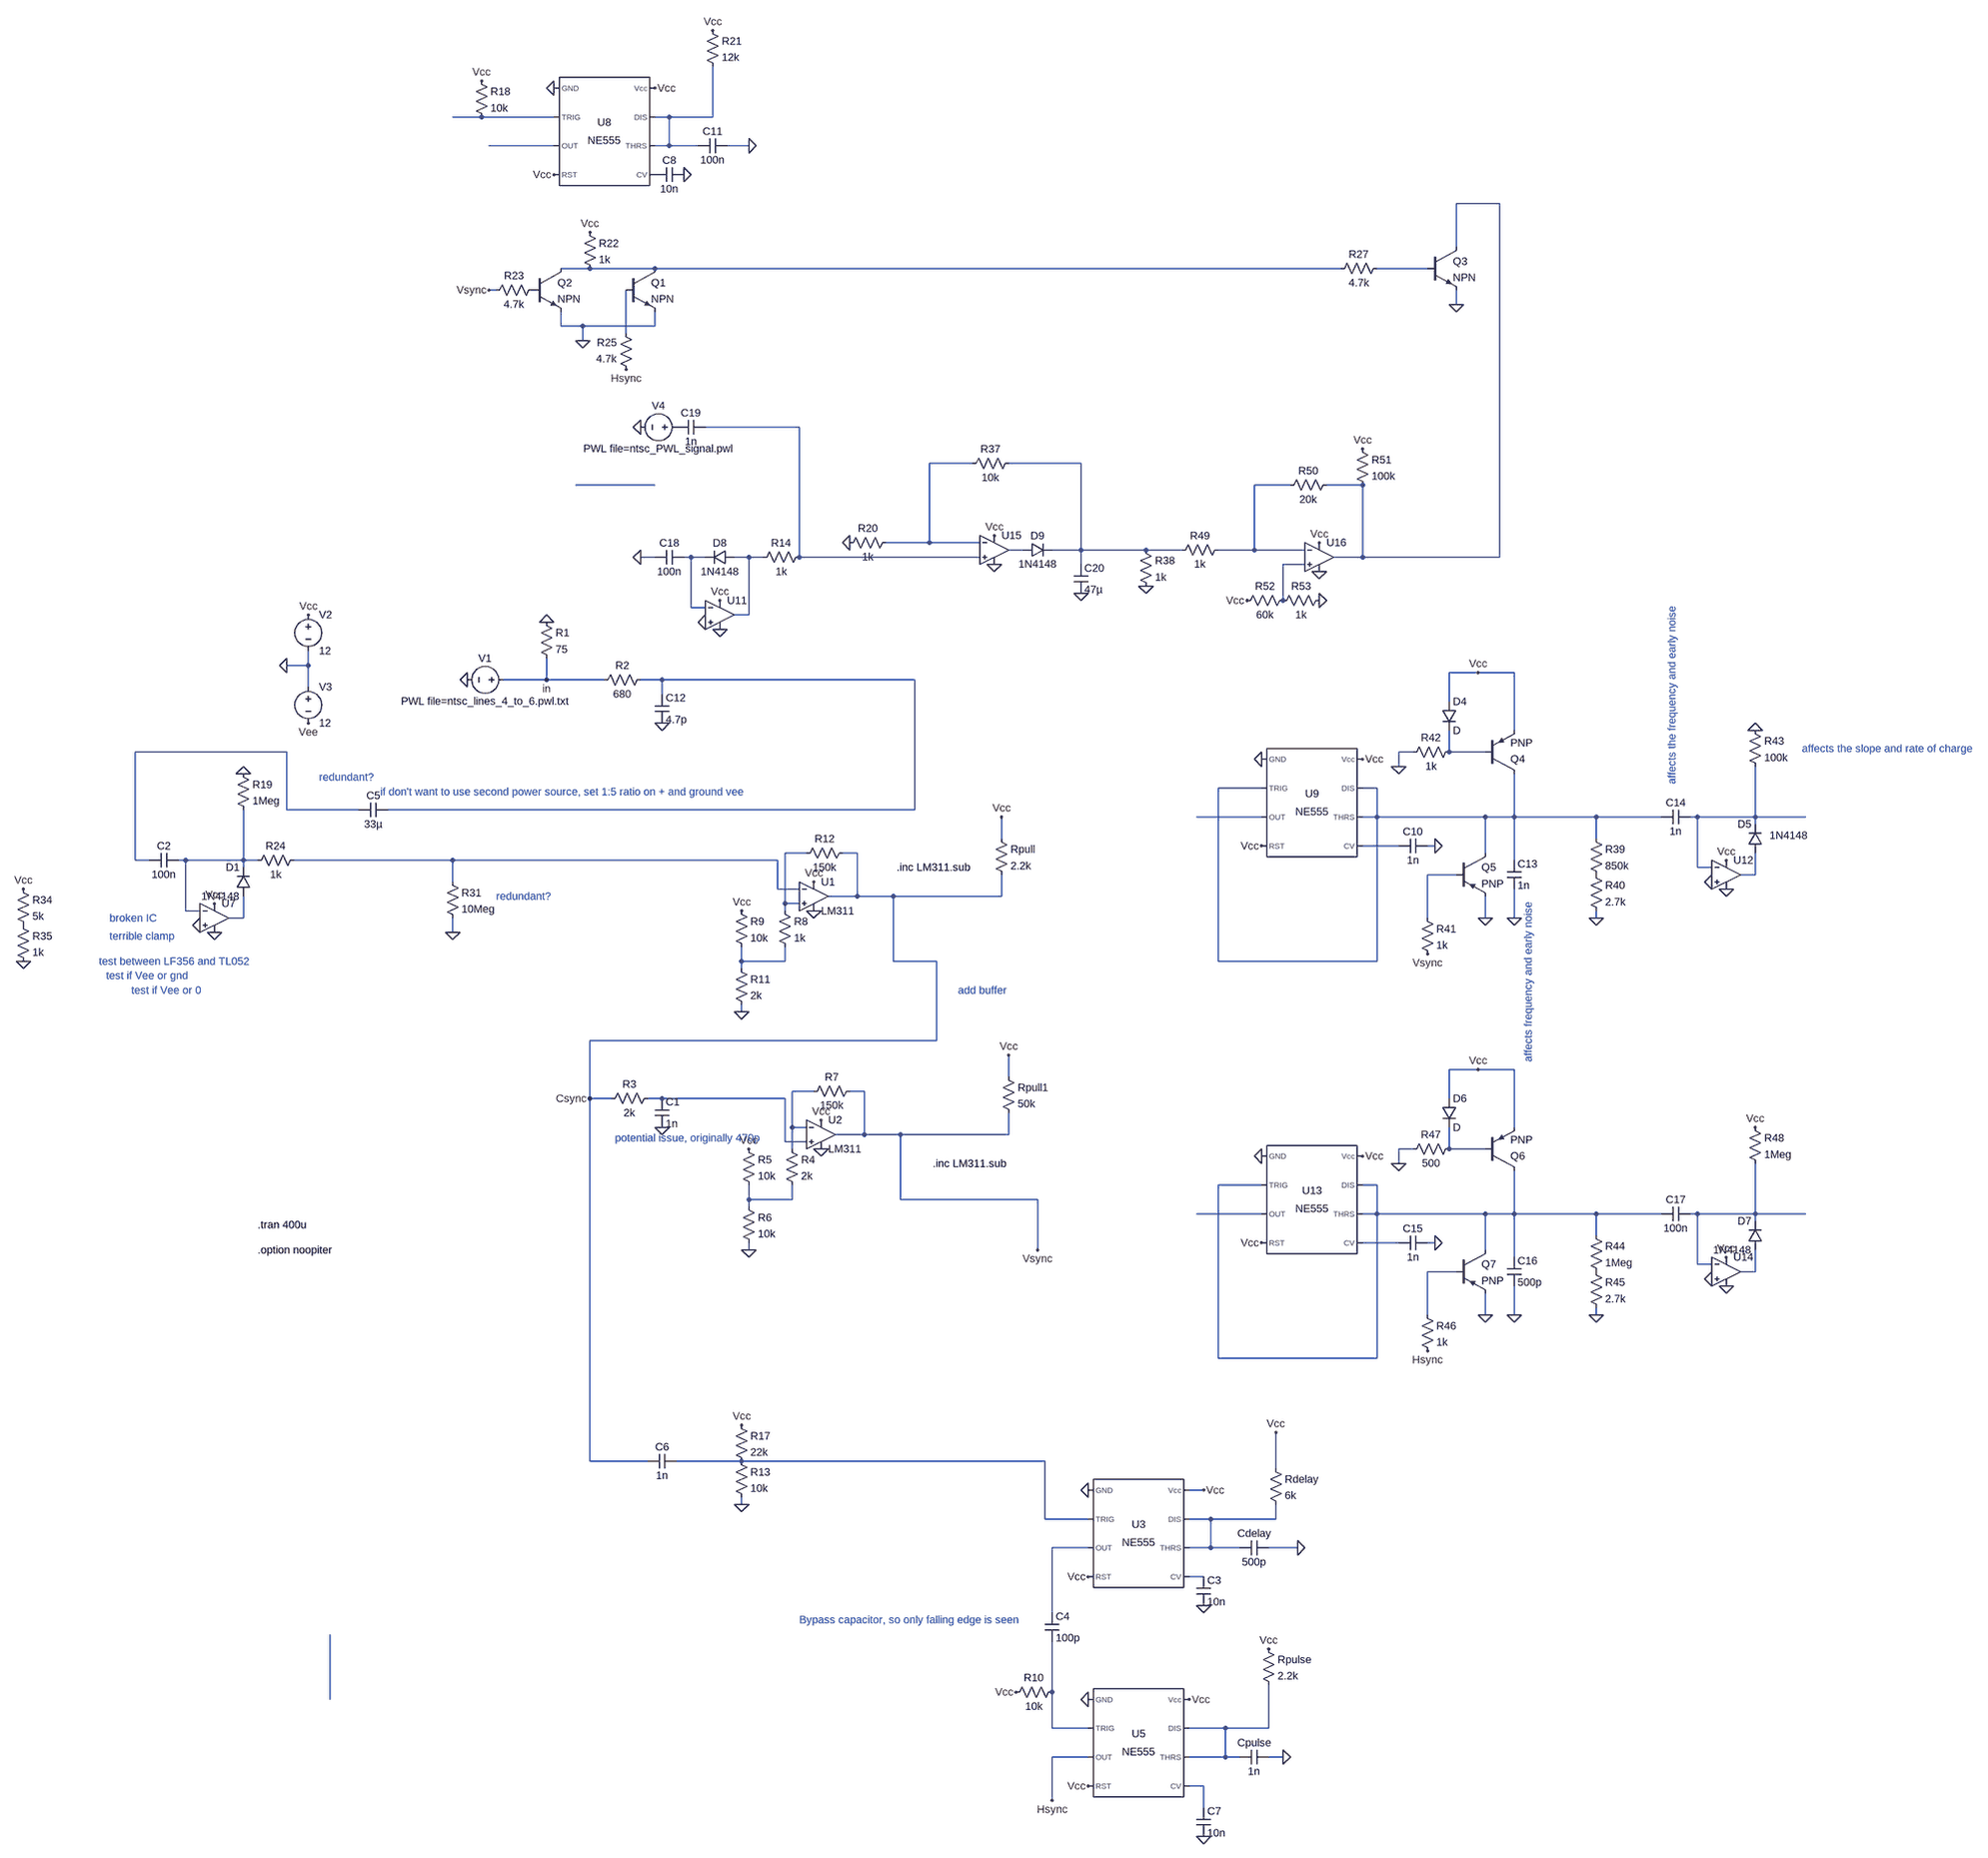
[diagram p0: schematic postFailurebutWOrse.asc]
postFailurebutWOrse.asc, the LTspice schematic file:
Version 4.1
SHEET 1 4812 2948
WIRE 16 -1440 -48 -1440
WIRE 176 -1440 16 -1440
WIRE 432 -1440 400 -1440
WIRE 528 -1440 528 -1552
WIRE 528 -1440 432 -1440
WIRE 176 -1376 32 -1376
WIRE 432 -1376 432 -1440
WIRE 432 -1376 400 -1376
WIRE 496 -1376 432 -1376
WIRE 608 -1376 560 -1376
WIRE 2272 -1248 2176 -1248
WIRE 2176 -1152 2176 -1248
WIRE 256 -1104 192 -1104
WIRE 400 -1104 256 -1104
WIRE 1920 -1104 400 -1104
WIRE 2112 -1104 2000 -1104
WIRE 48 -1056 32 -1056
WIRE 2176 -1024 2176 -1056
WIRE 192 -976 192 -1008
WIRE 240 -976 192 -976
WIRE 400 -976 400 -1008
WIRE 400 -976 240 -976
WIRE 336 -960 336 -1056
WIRE 240 -944 240 -976
WIRE 720 -752 512 -752
WIRE 1104 -672 1008 -672
WIRE 1344 -672 1184 -672
WIRE 400 -624 224 -624
WIRE 1808 -624 1728 -624
WIRE 1968 -624 1888 -624
WIRE 1008 -496 1008 -672
WIRE 1008 -496 912 -496
WIRE 1120 -496 1008 -496
WIRE 1216 -480 1184 -480
WIRE 1344 -480 1344 -672
WIRE 1344 -480 1280 -480
WIRE 1488 -480 1344 -480
WIRE 1568 -480 1488 -480
WIRE 1728 -480 1728 -624
WIRE 1728 -480 1648 -480
WIRE 1840 -480 1728 -480
WIRE 400 -464 368 -464
WIRE 480 -464 464 -464
WIRE 512 -464 480 -464
WIRE 608 -464 576 -464
WIRE 640 -464 608 -464
WIRE 720 -464 720 -752
WIRE 1120 -464 720 -464
WIRE 1968 -464 1968 -624
WIRE 1968 -464 1904 -464
WIRE 2272 -464 2272 -1248
WIRE 2272 -464 1968 -464
WIRE 1344 -448 1344 -480
WIRE 1840 -448 1792 -448
WIRE 1792 -368 1792 -448
WIRE 480 -352 480 -464
WIRE 512 -352 480 -352
WIRE 608 -336 608 -464
WIRE 608 -336 576 -336
WIRE -368 -224 -368 -256
WIRE -368 -224 -416 -224
WIRE 2224 -208 2160 -208
WIRE 2304 -208 2224 -208
WIRE 160 -192 160 -240
WIRE 160 -192 64 -192
WIRE 288 -192 160 -192
WIRE 416 -192 368 -192
WIRE 976 -192 416 -192
WIRE -368 -176 -368 -224
WIRE 416 -160 416 -192
WIRE 2160 -144 2160 -208
WIRE 2304 -80 2304 -208
WIRE -416 -32 -752 -32
WIRE 2080 -32 2048 -32
WIRE 2160 -32 2160 -80
WIRE 2240 -32 2160 -32
WIRE 2048 0 2048 -32
WIRE 1744 48 1648 48
WIRE 2000 48 1968 48
WIRE -416 96 -416 -32
WIRE -256 96 -416 96
WIRE 976 96 976 -192
WIRE 976 96 -192 96
WIRE 1744 112 1600 112
WIRE 2000 112 2000 48
WIRE 2000 112 1968 112
WIRE 2240 112 2000 112
WIRE 2304 112 2304 16
WIRE 2304 112 2240 112
WIRE 2496 112 2304 112
WIRE 2640 112 2496 112
WIRE 2720 112 2704 112
WIRE 2848 112 2848 0
WIRE 2848 112 2720 112
WIRE 2960 112 2848 112
WIRE 2848 128 2848 112
WIRE 1168 160 1168 112
WIRE 2496 160 2496 112
WIRE 2048 176 1968 176
WIRE 2128 176 2112 176
WIRE 736 192 688 192
WIRE 848 192 816 192
WIRE 2240 192 2240 112
WIRE -752 208 -752 -32
WIRE -720 208 -752 208
WIRE -640 208 -656 208
WIRE -512 208 -512 96
WIRE -512 208 -640 208
WIRE -480 208 -512 208
WIRE -48 208 -400 208
WIRE 672 208 -48 208
WIRE 2304 208 2304 112
WIRE -512 224 -512 208
WIRE 2720 224 2720 112
WIRE 2752 224 2720 224
WIRE 2176 240 2112 240
WIRE 2848 240 2848 192
WIRE 2848 240 2816 240
WIRE -48 256 -48 208
WIRE 672 272 672 208
WIRE 720 272 672 272
WIRE 848 288 848 192
WIRE 848 288 784 288
WIRE 928 288 848 288
WIRE 1168 288 1168 240
WIRE 1168 288 928 288
WIRE 688 304 688 192
WIRE 720 304 688 304
WIRE -640 320 -640 208
WIRE -608 320 -640 320
WIRE 688 320 688 304
WIRE -512 336 -512 288
WIRE -512 336 -544 336
WIRE 2112 336 2112 240
WIRE 2240 336 2240 288
WIRE 2304 336 2304 272
WIRE 2496 336 2496 320
WIRE -48 368 -48 336
WIRE 592 432 592 400
WIRE 688 432 688 400
WIRE 688 432 592 432
WIRE 928 432 928 288
WIRE 1024 432 928 432
WIRE 1648 432 1648 48
WIRE 2000 432 2000 112
WIRE 2000 432 1648 432
WIRE 592 448 592 432
WIRE 592 544 592 528
WIRE 1024 608 1024 432
WIRE 1024 608 256 608
WIRE 2224 672 2160 672
WIRE 2304 672 2224 672
WIRE 1184 688 1184 640
WIRE 752 720 704 720
WIRE 864 720 832 720
WIRE 256 736 256 608
WIRE 304 736 256 736
WIRE 416 736 384 736
WIRE 688 736 416 736
WIRE 2160 736 2160 672
WIRE 704 800 704 720
WIRE 736 800 704 800
WIRE 2304 800 2304 672
WIRE 864 816 864 720
WIRE 864 816 800 816
WIRE 944 816 864 816
WIRE 1184 816 1184 768
WIRE 1184 816 944 816
WIRE 688 832 688 736
WIRE 736 832 688 832
WIRE 704 848 704 800
WIRE 2080 848 2048 848
WIRE 2160 848 2160 800
WIRE 2240 848 2160 848
WIRE 2048 880 2048 848
WIRE 1744 928 1648 928
WIRE 2000 928 1968 928
WIRE 608 960 608 928
WIRE 704 960 704 928
WIRE 704 960 608 960
WIRE 944 960 944 816
WIRE 1248 960 944 960
WIRE 608 976 608 960
WIRE 1744 992 1600 992
WIRE 2000 992 2000 928
WIRE 2000 992 1968 992
WIRE 2240 992 2000 992
WIRE 2304 992 2304 896
WIRE 2304 992 2240 992
WIRE 2496 992 2304 992
WIRE 2640 992 2496 992
WIRE 2720 992 2704 992
WIRE 2848 992 2848 880
WIRE 2848 992 2720 992
WIRE 2960 992 2848 992
WIRE 2848 1008 2848 992
WIRE 2496 1040 2496 992
WIRE 2048 1056 1968 1056
WIRE 2128 1056 2112 1056
WIRE 608 1072 608 1056
WIRE 1248 1072 1248 960
WIRE 2240 1072 2240 992
WIRE 2304 1088 2304 992
WIRE 2720 1104 2720 992
WIRE 2752 1104 2720 1104
WIRE 2176 1120 2112 1120
WIRE 2848 1120 2848 1072
WIRE 2848 1120 2816 1120
WIRE 2112 1216 2112 1120
WIRE 2240 1216 2240 1168
WIRE 2304 1216 2304 1152
WIRE 2496 1216 2496 1200
WIRE 1648 1312 1648 928
WIRE 2000 1312 2000 992
WIRE 2000 1312 1648 1312
WIRE 256 1632 256 736
WIRE 384 1632 256 1632
WIRE 592 1632 448 1632
WIRE 1264 1632 592 1632
WIRE 1776 1648 1776 1568
WIRE 1616 1696 1584 1696
WIRE 592 1728 592 1712
WIRE 1264 1760 1264 1632
WIRE 1360 1760 1264 1760
WIRE 1632 1760 1584 1760
WIRE 1776 1760 1776 1728
WIRE 1776 1760 1632 1760
WIRE 1360 1824 1280 1824
WIRE 1632 1824 1632 1760
WIRE 1632 1824 1584 1824
WIRE 1696 1824 1632 1824
WIRE 1824 1824 1760 1824
WIRE 1616 1888 1584 1888
WIRE 1280 1968 1280 1824
WIRE 1280 2144 1280 2032
WIRE -320 2160 -320 2016
WIRE 1280 2224 1280 2144
WIRE 1360 2224 1280 2224
WIRE 1664 2224 1584 2224
WIRE 1760 2224 1760 2128
WIRE 1760 2224 1664 2224
WIRE 1360 2288 1280 2288
WIRE 1664 2288 1664 2224
WIRE 1664 2288 1584 2288
WIRE 1696 2288 1664 2288
WIRE 1792 2288 1760 2288
WIRE 1616 2352 1584 2352
WIRE 1280 2384 1280 2288
WIRE 1616 2400 1616 2352
FLAG -16 -192 0
FLAG 160 -320 0
FLAG 416 -96 0
FLAG 592 544 0
FLAG 752 256 Vcc
FLAG -368 -336 Vcc
FLAG -368 -96 Vee
FLAG -416 -224 0
FLAG 1168 112 Vcc
FLAG 592 320 Vcc
FLAG -48 368 0
FLAG 416 800 0
FLAG -576 304 Vcc
FLAG 608 1072 0
FLAG 1184 640 Vcc
FLAG 608 848 Vcc
FLAG 768 848 0
FLAG 1248 1072 Vsync
FLAG 256 736 Csync
FLAG 1360 1696 0
FLAG 1360 1888 Vcc
FLAG -1056 432 0
FLAG -1056 272 Vcc
FLAG -608 352 0
FLAG 160 -192 in
FLAG 768 784 Vcc
FLAG -576 368 0
FLAG 752 320 0
FLAG -512 16 0
FLAG 1616 1696 Vcc
FLAG 1776 1568 Vcc
FLAG 1824 1824 0
FLAG 1616 1952 0
FLAG 1200 2144 Vcc
FLAG 1360 2160 0
FLAG 1584 2160 Vcc
FLAG 1760 2048 Vcc
FLAG 1792 2288 0
FLAG 1360 2352 Vcc
FLAG 1280 2384 Hsync
FLAG 1616 2464 0
FLAG 592 1552 Vcc
FLAG 592 1728 0
FLAG 176 -1504 0
FLAG 400 -1504 Vcc
FLAG 176 -1312 Vcc
FLAG 16 -1520 Vcc
FLAG 32 -1056 Vsync
FLAG 464 -1312 0
FLAG 528 -1632 Vcc
FLAG 608 -1376 0
FLAG 240 -944 0
FLAG 256 -1184 Vcc
FLAG 336 -880 Hsync
FLAG 2176 -1024 0
FLAG 368 -752 0
FLAG 1744 -16 0
FLAG 1744 176 Vcc
FLAG 1968 -16 Vcc
FLAG 2128 176 0
FLAG 2304 336 0
FLAG 2224 -208 Vcc
FLAG 2496 336 0
FLAG 2240 336 0
FLAG 2048 0 0
FLAG 2784 208 Vcc
FLAG 2752 256 0
FLAG 2784 272 0
FLAG 1744 864 0
FLAG 1744 1056 Vcc
FLAG 1968 864 Vcc
FLAG 2128 1056 0
FLAG 2304 1216 0
FLAG 2224 672 Vcc
FLAG 2496 1216 0
FLAG 2240 1216 0
FLAG 2112 1296 Hsync
FLAG 2048 880 0
FLAG 2784 1088 Vcc
FLAG 2752 1136 0
FLAG 2784 1152 0
FLAG 2112 416 Vsync
FLAG 2848 -80 0
FLAG 2848 800 Vcc
FLAG 368 -464 0
FLAG 544 -368 Vcc
FLAG 512 -320 0
FLAG 1152 -512 Vcc
FLAG 832 -496 0
FLAG 1344 -384 0
FLAG 1488 -400 0
FLAG 1872 -496 Vcc
FLAG 1968 -704 Vcc
FLAG 544 -304 0
FLAG 1872 -368 0
FLAG 1712 -368 Vcc
FLAG 1872 -432 0
FLAG 1152 -448 0
DATAFLAG 592 432 ""
DATAFLAG 608 960 ""
DATAFLAG 1248 960 ""
SYMBOL voltage 80 -192 R90
WINDOW 0 -32 56 VBottom 2
WINDOW 3 32 56 VTop 2
WINDOW 123 0 0 Left 0
WINDOW 39 0 0 Left 0
SYMATTR InstName V1
SYMATTR Value PWL file=ntsc_lines_4_to_6.pwl.txt
SYMBOL res 144 -336 R0
SYMATTR InstName R1
SYMATTR Value 75
SYMBOL res 384 -208 R90
WINDOW 0 0 56 VBottom 2
WINDOW 3 32 56 VTop 2
SYMATTR InstName R2
SYMATTR Value 680
SYMBOL cap 400 -160 R0
SYMATTR InstName C12
SYMATTR Value 4.7p
SYMBOL res 672 304 R0
SYMATTR InstName R8
SYMATTR Value 1k
SYMBOL res 576 304 R0
SYMATTR InstName R9
SYMATTR Value 10k
SYMBOL res 576 432 R0
SYMATTR InstName R11
SYMATTR Value 2k
SYMBOL res 832 176 R90
WINDOW 0 0 56 VBottom 2
WINDOW 3 32 56 VTop 2
SYMATTR InstName R12
SYMATTR Value 150k
SYMBOL res 1152 144 R0
SYMATTR InstName Rpull
SYMATTR Value 2.2k
SYMBOL voltage -368 -352 R0
SYMATTR InstName V2
SYMATTR Value 12
SYMBOL voltage -368 -192 R0
SYMATTR InstName V3
SYMATTR Value 12
SYMBOL OpAmps\\opamp2 752 224 R0
SYMATTR InstName U1
SYMATTR Value LM311
SYMBOL res -64 240 R0
SYMATTR InstName R31
SYMATTR Value 10Meg
SYMBOL res 400 720 R90
WINDOW 0 0 56 VBottom 2
WINDOW 3 32 56 VTop 2
SYMATTR InstName R3
SYMATTR Value 2k
SYMBOL cap 400 736 R0
SYMATTR InstName C1
SYMATTR Value 1n
SYMBOL res -384 192 R90
WINDOW 0 0 56 VBottom 2
WINDOW 3 32 56 VTop 2
SYMATTR InstName R24
SYMATTR Value 1k
SYMBOL diode -496 288 R180
WINDOW 0 24 64 Left 2
WINDOW 3 24 0 Left 2
SYMATTR InstName D1
SYMATTR Value 1N4148
SYMBOL cap -656 192 R90
WINDOW 0 0 32 VBottom 2
WINDOW 3 32 32 VTop 2
SYMATTR InstName C2
SYMATTR Value 100n
SYMBOL OpAmps\\UniversalOpAmp2 -576 336 R0
SYMATTR InstName U7
SYMBOL res 688 832 R0
SYMATTR InstName R4
SYMATTR Value 2k
SYMBOL res 592 832 R0
SYMATTR InstName R5
SYMATTR Value 10k
SYMBOL res 592 960 R0
SYMATTR InstName R6
SYMATTR Value 10k
SYMBOL res 848 704 R90
WINDOW 0 0 56 VBottom 2
WINDOW 3 32 56 VTop 2
SYMATTR InstName R7
SYMATTR Value 150k
SYMBOL res 1168 672 R0
SYMATTR InstName Rpull1
SYMATTR Value 50k
SYMBOL OpAmps\\opamp2 768 752 R0
SYMATTR InstName U2
SYMATTR Value LM311
SYMBOL Misc\\NE555 1472 1792 R0
SYMATTR InstName U3
SYMBOL res -1072 256 R0
SYMATTR InstName R34
SYMATTR Value 5k
SYMBOL res -1072 336 R0
SYMATTR InstName R35
SYMATTR Value 1k
SYMBOL res -528 0 R0
SYMATTR InstName R19
SYMATTR Value 1Meg
SYMBOL cap -192 80 R90
WINDOW 0 0 32 VBottom 2
WINDOW 3 32 32 VTop 2
SYMATTR InstName C5
SYMATTR Value 33µ
SYMBOL res 1760 1632 R0
SYMATTR InstName Rdelay
SYMATTR Value 6k
SYMBOL cap 1760 1808 R90
WINDOW 0 0 32 VBottom 2
WINDOW 3 32 32 VTop 2
SYMATTR InstName Cdelay
SYMATTR Value 500p
SYMBOL cap 1600 1888 R0
SYMATTR InstName C3
SYMATTR Value 10n
SYMBOL cap 1264 1968 R0
SYMATTR InstName C4
SYMATTR Value 100p
SYMBOL res 1296 2128 R90
WINDOW 0 0 56 VBottom 2
WINDOW 3 32 56 VTop 2
SYMATTR InstName R10
SYMATTR Value 10k
SYMBOL Misc\\NE555 1472 2256 R0
SYMATTR InstName U5
SYMBOL res 1744 2032 R0
SYMATTR InstName Rpulse
SYMATTR Value 2.2k
SYMBOL cap 1760 2272 R90
WINDOW 0 0 32 VBottom 2
WINDOW 3 32 32 VTop 2
SYMATTR InstName Cpulse
SYMATTR Value 1n
SYMBOL cap 1600 2400 R0
SYMATTR InstName C7
SYMATTR Value 10n
SYMBOL res 576 1616 R0
SYMATTR InstName R13
SYMATTR Value 10k
SYMBOL cap 448 1616 R90
WINDOW 0 0 32 VBottom 2
WINDOW 3 32 32 VTop 2
SYMATTR InstName C6
SYMATTR Value 1n
SYMBOL res 576 1536 R0
SYMATTR InstName R17
SYMATTR Value 22k
SYMBOL Misc\\NE555 288 -1408 R0
SYMATTR InstName U8
SYMBOL res 0 -1536 R0
SYMATTR InstName R18
SYMATTR Value 10k
SYMBOL cap 464 -1328 R90
WINDOW 0 0 32 VBottom 2
WINDOW 3 32 32 VTop 2
SYMATTR InstName C8
SYMATTR Value 10n
SYMBOL res 512 -1648 R0
SYMATTR InstName R21
SYMATTR Value 12k
SYMBOL cap 560 -1392 R90
WINDOW 0 0 32 VBottom 2
WINDOW 3 32 32 VTop 2
SYMATTR InstName C11
SYMATTR Value 100n
SYMBOL npn 336 -1104 R0
SYMATTR InstName Q1
SYMBOL npn 128 -1104 R0
SYMATTR InstName Q2
SYMBOL res 240 -1200 R0
SYMATTR InstName R22
SYMATTR Value 1k
SYMBOL res 144 -1072 R90
WINDOW 0 0 56 VBottom 2
WINDOW 3 32 56 VTop 2
SYMATTR InstName R23
SYMATTR Value 4.7k
SYMBOL res 352 -864 R180
WINDOW 0 36 76 Left 2
WINDOW 3 36 40 Left 2
SYMATTR InstName R25
SYMATTR Value 4.7k
SYMBOL npn 2112 -1152 R0
SYMATTR InstName Q3
SYMBOL res 2016 -1120 R90
WINDOW 0 0 56 VBottom 2
WINDOW 3 32 56 VTop 2
SYMATTR InstName R27
SYMATTR Value 4.7k
SYMBOL voltage 464 -752 R90
WINDOW 0 -32 56 VBottom 2
WINDOW 3 32 56 VTop 2
WINDOW 123 0 0 Left 0
WINDOW 39 0 0 Left 0
SYMATTR InstName V4
SYMATTR Value PWL file=ntsc_PWL_signal.pwl
SYMBOL Misc\\NE555 1856 80 R0
SYMATTR InstName U9
SYMBOL cap 2112 160 R90
WINDOW 0 0 32 VBottom 2
WINDOW 3 32 32 VTop 2
SYMATTR InstName C10
SYMATTR Value 1n
SYMBOL cap 2288 208 R0
SYMATTR InstName C13
SYMATTR Value 1n
SYMBOL pnp 2240 16 M180
SYMATTR InstName Q4
SYMBOL diode 2144 -144 R0
SYMATTR InstName D4
SYMBOL res 2480 144 R0
SYMATTR InstName R39
SYMATTR Value 850k
SYMBOL res 2480 224 R0
SYMATTR InstName R40
SYMATTR Value 2.7k
SYMBOL res 2096 320 R0
SYMATTR InstName R41
SYMATTR Value 1k
SYMBOL res 2176 -48 R90
WINDOW 0 0 56 VBottom 2
WINDOW 3 32 56 VTop 2
SYMATTR InstName R42
SYMATTR Value 1k
SYMBOL pnp 2176 192 R0
SYMATTR InstName Q5
SYMBOL diode 2864 192 R180
WINDOW 0 24 64 Left 2
WINDOW 3 -101 39 Left 2
SYMATTR InstName D5
SYMATTR Value 1N4148
SYMBOL cap 2704 96 R90
WINDOW 0 0 32 VBottom 2
WINDOW 3 32 32 VTop 2
SYMATTR InstName C14
SYMATTR Value 1n
SYMBOL OpAmps\\UniversalOpAmp2 2784 240 R0
SYMATTR InstName U12
SYMBOL res 2832 -96 R0
SYMATTR InstName R43
SYMATTR Value 100k
SYMBOL Misc\\NE555 1856 960 R0
SYMATTR InstName U13
SYMBOL cap 2112 1040 R90
WINDOW 0 0 32 VBottom 2
WINDOW 3 32 32 VTop 2
SYMATTR InstName C15
SYMATTR Value 1n
SYMBOL cap 2288 1088 R0
SYMATTR InstName C16
SYMATTR Value 500p
SYMBOL pnp 2240 896 M180
SYMATTR InstName Q6
SYMBOL diode 2144 736 R0
SYMATTR InstName D6
SYMBOL res 2480 1024 R0
SYMATTR InstName R44
SYMATTR Value 1Meg
SYMBOL res 2480 1104 R0
SYMATTR InstName R45
SYMATTR Value 2.7k
SYMBOL res 2096 1200 R0
SYMATTR InstName R46
SYMATTR Value 1k
SYMBOL res 2176 832 R90
WINDOW 0 0 56 VBottom 2
WINDOW 3 32 56 VTop 2
SYMATTR InstName R47
SYMATTR Value 500
SYMBOL pnp 2176 1072 R0
SYMATTR InstName Q7
SYMBOL diode 2864 1072 R180
WINDOW 0 24 64 Left 2
WINDOW 3 24 0 Left 2
SYMATTR InstName D7
SYMATTR Value 1N4148
SYMBOL cap 2704 976 R90
WINDOW 0 0 32 VBottom 2
WINDOW 3 32 32 VTop 2
SYMATTR InstName C17
SYMATTR Value 100n
SYMBOL OpAmps\\UniversalOpAmp2 2784 1120 R0
SYMATTR InstName U14
SYMBOL res 2832 784 R0
SYMATTR InstName R48
SYMATTR Value 1Meg
SYMBOL res 736 -480 R90
WINDOW 0 0 56 VBottom 2
WINDOW 3 32 56 VTop 2
SYMATTR InstName R14
SYMATTR Value 1k
SYMBOL diode 576 -480 R90
WINDOW 0 0 32 VBottom 2
WINDOW 3 32 32 VTop 2
SYMATTR InstName D8
SYMATTR Value 1N4148
SYMBOL cap 464 -480 R90
WINDOW 0 0 32 VBottom 2
WINDOW 3 32 32 VTop 2
SYMATTR InstName C18
SYMATTR Value 100n
SYMBOL OpAmps\\UniversalOpAmp2 544 -336 R0
SYMATTR InstName U11
SYMBOL cap 512 -768 R90
WINDOW 0 0 32 VBottom 2
WINDOW 3 32 32 VTop 2
SYMATTR InstName C19
SYMATTR Value 1n
SYMBOL OpAmps\\UniversalOpAmp2 1152 -480 R0
SYMATTR InstName U15
SYMBOL diode 1216 -464 R270
WINDOW 0 32 32 VTop 2
WINDOW 3 0 32 VBottom 2
SYMATTR InstName D9
SYMATTR Value 1N4148
SYMBOL res 928 -512 R90
WINDOW 0 0 56 VBottom 2
WINDOW 3 32 56 VTop 2
SYMATTR InstName R20
SYMATTR Value 1k
SYMBOL res 1200 -688 R90
WINDOW 0 0 56 VBottom 2
WINDOW 3 32 56 VTop 2
SYMATTR InstName R37
SYMATTR Value 10k
SYMBOL cap 1328 -448 R0
SYMATTR InstName C20
SYMATTR Value 47µ
SYMBOL res 1472 -496 R0
SYMATTR InstName R38
SYMATTR Value 1k
SYMBOL res 1664 -496 R90
WINDOW 0 0 56 VBottom 2
WINDOW 3 32 56 VTop 2
SYMATTR InstName R49
SYMATTR Value 1k
SYMBOL OpAmps\\UniversalOpAmp2 1872 -464 R0
SYMATTR InstName U16
SYMBOL res 1904 -640 R90
WINDOW 0 0 56 VBottom 2
WINDOW 3 32 56 VTop 2
SYMATTR InstName R50
SYMATTR Value 20k
SYMBOL res 1952 -720 R0
SYMATTR InstName R51
SYMATTR Value 100k
SYMBOL res 1808 -384 R90
WINDOW 0 0 56 VBottom 2
WINDOW 3 32 56 VTop 2
SYMATTR InstName R52
SYMATTR Value 60k
SYMBOL res 1888 -384 R90
WINDOW 0 0 56 VBottom 2
WINDOW 3 32 56 VTop 2
SYMATTR InstName R53
SYMATTR Value 1k
TEXT -480 1016 Left 2 !.tran 400u
TEXT 936 224 Left 2 !.inc LM311.sub
TEXT 1016 880 Left 2 !.inc LM311.sub
TEXT -208 56 Left 2 ;if don't want to use second power source, set 1:5 ratio on + and ground vee
TEXT -808 336 Left 2 ;broken IC
TEXT -808 376 Left 2 ;terrible clamp
TEXT -832 432 Left 2 ;test between LF356 and TL052
TEXT 48 288 Left 2 ;redundant?
TEXT -344 24 Left 2 ;redundant?
TEXT -816 464 Left 2 ;test if Vee or gnd
TEXT 720 1984 Left 2 ;Bypass capacitor, so only falling edge is seen
TEXT -480 1072 Left 2 !.option noopiter
TEXT 1072 496 Left 2 ;add buffer
TEXT -760 496 Left 2 ;test if Vee or 0
TEXT 312 824 Left 2 ;potential issue, originally 470p
TEXT 2952 -40 Left 2 ;affects the slope and rate of charge
TEXT 2664 40 VLeft 2 ;affects the frequency and early noise
TEXT 2336 656 VLeft 2 ;affects frequency and early noise

The netlist it stands for:
* postFailurebutWOrse.asc
V1 in 0 PWL file=ntsc_lines_4_to_6.pwl.txt
R1 0 in 75
R2 N017 in 680
C12 N017 0 4.7p
R8 N024 N030 1k
R9 Vcc N030 10k
R11 N030 0 2k
R12 Csync N024 150k
Rpull Vcc Csync 2.2k
V2 Vcc 0 12
V3 0 Vee 12
X§U1 N024 N026 Vcc 0 Csync LM311  ; pins In+ In- V+ V- OUT
R31 N026 0 10Meg
R3 N032 Csync 2k
C1 N032 0 1n
R24 N026 N025 1k
D1 N029 N025 1N4148
C2 N025 N018 100n
X§U7 0 N025 Vcc 0 N029 level2 Avol=1Meg GBW=10Meg Slew=10Meg Ilimit=25m Rail=0 Vos=0 En=0 Enk=0 In=0 Ink=0 Rin=500Meg  ; pins In+ In- V+ V- OUT
R4 N031 N035 2k
R5 Vcc N035 10k
R6 N035 0 10k
R7 Vsync N031 150k
Rpull1 Vcc Vsync 50k
X§U2 N032 N031 Vcc 0 Vsync LM311  ; pins In+ In- V+ V- OUT
X§U3 0 N041 N043 Vcc N044 N042 N042 Vcc NE555  ; pins GND TRIG OUT RST CV THRS DIS Vcc
R34 Vcc P001 5k
R35 P001 0 1k
R19 0 N025 1Meg
C5 N017 N018 33µ
Rdelay Vcc N042 6k
Cdelay 0 N042 500p
C3 N044 0 10n
C4 N043 N045 100p
R10 N045 Vcc 10k
X§U5 0 N045 Hsync Vcc N048 N047 N047 Vcc NE555  ; pins GND TRIG OUT RST CV THRS DIS Vcc
Rpulse Vcc N047 2.2k
Cpulse 0 N047 1n
C7 N048 0 10n
R13 N041 0 10k
C6 N041 Csync 1n
R17 Vcc N041 22k
X§U8 0 N001 N003 Vcc P002 N002 N002 Vcc NE555  ; pins GND TRIG OUT RST CV THRS DIS Vcc
R18 Vcc N001 10k
C8 0 P002 10n
R21 Vcc N002 12k
C11 0 N002 100n
Q1 N005 N007 0 0 NPN
Q2 N005 P003 0 0 NPN
R22 Vcc N005 1k
R23 P003 Vsync 4.7k
R25 Hsync N007 4.7k
Q3 N004 N006 0 0 NPN
R27 N006 N005 4.7k
V4 P004 0 PWL file=ntsc_PWL_signal.pwl
X§U9 0 N020 N021 Vcc N023 N020 N020 Vcc NE555  ; pins GND TRIG OUT RST CV THRS DIS Vcc
C10 0 N023 1n
C13 N020 0 1n
Q4 N020 N019 Vcc 0 PNP
D4 Vcc N019 D
R39 N020 P005 850k
R40 P005 0 2.7k
R41 N027 Vsync 1k
R42 N019 0 1k
Q5 N020 N027 0 0 PNP
D5 N028 N022 1N4148
C14 N022 N020 1n
X§U12 0 N022 Vcc 0 N028 level2 Avol=1Meg GBW=10Meg Slew=10Meg Ilimit=25m Rail=0 Vos=0 En=0 Enk=0 In=0 Ink=0 Rin=500Meg  ; pins In+ In- V+ V- OUT
R43 0 N022 100k
X§U13 0 N034 N036 Vcc N038 N034 N034 Vcc NE555  ; pins GND TRIG OUT RST CV THRS DIS Vcc
C15 0 N038 1n
C16 N034 0 500p
Q6 N034 N033 Vcc 0 PNP
D6 Vcc N033 D
R44 N034 P006 1Meg
R45 P006 0 2.7k
R46 N039 Hsync 1k
R47 N033 0 500
Q7 N034 N039 0 0 PNP
D7 N040 N037 1N4148
C17 N037 N034 100n
X§U14 0 N037 Vcc 0 N040 level2 Avol=1Meg GBW=10Meg Slew=10Meg Ilimit=25m Rail=0 Vos=0 En=0 Enk=0 In=0 Ink=0 Rin=500Meg  ; pins In+ In- V+ V- OUT
R48 Vcc N037 1Meg
R14 N008 N015 1k
D8 N015 N014 1N4148
C18 N014 0 100n
X§U11 0 N014 Vcc 0 N015 level2 Avol=1Meg GBW=10Meg Slew=10Meg Ilimit=25m Rail=0 Vos=0 En=0 Enk=0 In=0 Ink=0 Rin=500Meg  ; pins In+ In- V+ V- OUT
C19 N008 P004 1n
X§U15 N008 N009 Vcc 0 N013 level2 Avol=1Meg GBW=10Meg Slew=10Meg Ilimit=25m Rail=0 Vos=0 En=0 Enk=0 In=0 Ink=0 Rin=500Meg  ; pins In+ In- V+ V- OUT
D9 N013 N010 1N4148
R20 N009 0 1k
R37 N010 N009 10k
C20 N010 0 47µ
R38 N010 0 1k
R49 N012 N010 1k
X§U16 N016 N012 Vcc 0 N004 level2 Avol=1Meg GBW=10Meg Slew=10Meg Ilimit=25m Rail=0 Vos=0 En=0 Enk=0 In=0 Ink=0 Rin=500Meg  ; pins In+ In- V+ V- OUT
R50 N004 N012 20k
R51 Vcc N004 100k
R52 N016 Vcc 60k
R53 0 N016 1k
.model D D
.lib standard.dio
.model NPN NPN
.model PNP PNP
.lib standard.bjt
.tran 400u
.inc LM311.sub
.inc LM311.sub
* if don't want to use second power source, set 1:5 ratio on + and ground vee
* broken IC
* terrible clamp
* test between LF356 and TL052
* redundant?
* redundant?
* test if Vee or gnd
* Bypass capacitor, so only falling edge is seen
.option noopiter
* add buffer
* test if Vee or 0
* potential issue, originally 470p
* affects the slope and rate of charge
* affects the frequency and early noise
* affects frequency and early noise
.lib UniversalOpAmp2.lib
.lib NE555.sub
.backanno
.end